# EAGLE design Nunchuck v0.3 (EAGLE 7.1.0)
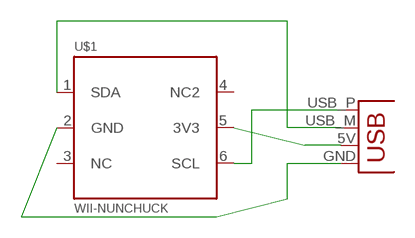
[diagram p0: schematic, sheet 1]

## Parts
JP1  USBPCB  [USB-A-PCB]
U$1  WII-NUNCHUCK  [WII_6PIN]

## Nets
N$1: JP1.GND U$1.2(GND)
N$2: JP1.5V(VBUS) U$1.5(3V3)
N$3: JP1.USB_M(D-) U$1.1(SDA)
N$4: JP1.USB_P(D+) U$1.6(SCL)
Unconnected: U$1.4(NC2)

## Power pins joined to a net without a drawn wire
NC: U$1.3(NC)

## Library data of the parts
JP1 = SparkFun-Connectors:USB: USB Connectors USB-B-PTH is fully proven SKU : PRT-00139/CONN-08278 USB-miniB is fully proven SKU : PRT-00587 USB-A-PCB is untested. USB-A-H is throughly reviewed, but untested. Spark Fun Electronics SKU : PRT-00437 USB-B-SMT is throughly reviewed, but untested. Needs silkscreen touching up. USB-A-S has not been used/tested USB-MB-H has not been used/tested USB-MICROB has been used. CONN-09505
U$1 = SparkFun-Connectors:WII-NUNCHUCK

## Board
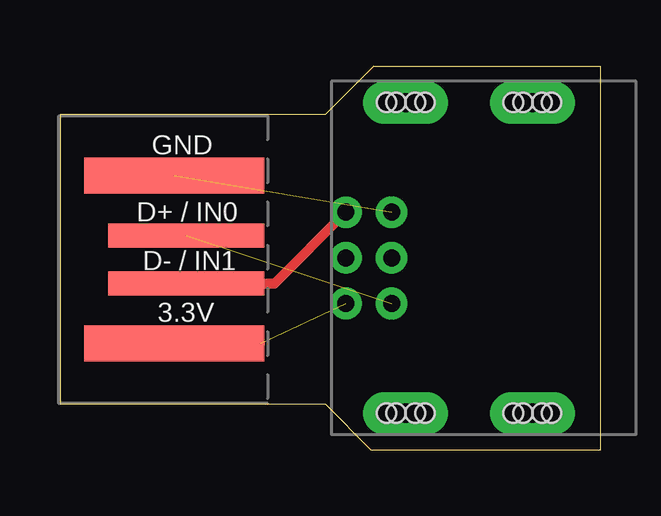
[diagram p1: board, top side]

Size 22.54 x 16 mm. Coordinates in mm from the lower left corner, seen from the top.
Outline: 22.54,16 22.54,0 12.95,0 11.05,1.91 0,1.91 0,13.97 11.05,13.97 13.08,16 22.53,16
Copper layers (1*16): Top 0.035mm / dielectric 1.5mm / Bottom 0.035mm
Design rules "SparkFun": minimum track width 8mil, minimum drill 20mil, track to track 8mil, track to pad 8mil, pad to pad 8mil, via to via 8mil, smd to smd 8mil, copper to edge 10mil, drill to drill 8mil, minimum pad ring 12mil, minimum via ring 10mil, stop-mask expansion 4mil, vias tented up to drill 25mil, thermal gap 10mil

### Footprints (pad centres in the part's own frame; a part is rotated, then mirrored left to right if it is on the bottom)
USB-A-PCB = smd 7.5 x 1.5: 5V -0.2,-3.5; GND -0.2,3.5 | smd 6.5 x 1: USB_M 0.3,-1; USB_P 0.3,1
WII_6PIN = drill 0.711: 1 -1.905,-5.74; 2 -1.905,-3.835; 3 0,-5.74; 4 0,-3.835; 5 1.905,-5.74; 6 1.905,-3.835 | drill 0.8 pad 1.778 long: P$7 -6.477,-3.251; P$8 -6.477,2.032; P$9 6.477,2.032; P$10 6.477,-3.251 | hole 0.8: -6.477,1.632; -6.477,1.232; -6.477,2.432; -6.477,2.832; 6.477,1.632; 6.477,1.232; 6.477,2.432; 6.477,2.832; 6.477,-3.651; 6.477,-4.051; 6.477,-2.851; 6.477,-2.451; -6.477,-3.651; -6.477,-4.051; -6.477,-2.851; -6.477,-2.451

### Placement (x,y rotation side)
JP1  4.95,7.93 0 top
U$1  17.65,8 270 top

### Tracks (layer width: path | path; a pad name or v marks a point on that pad's centre or on a via)
N$1  (1 unrouted)
N$2  (1 unrouted)
  Top 0.406: JP1.5V 8.34,4.43
N$3
  Top 0.406: JP1.USB_M 8.94,6.93 U$1.1
N$4  (1 unrouted)

### Text on the board
tNames: GND | D+ / IN0 | D- / IN1 | 3.3V